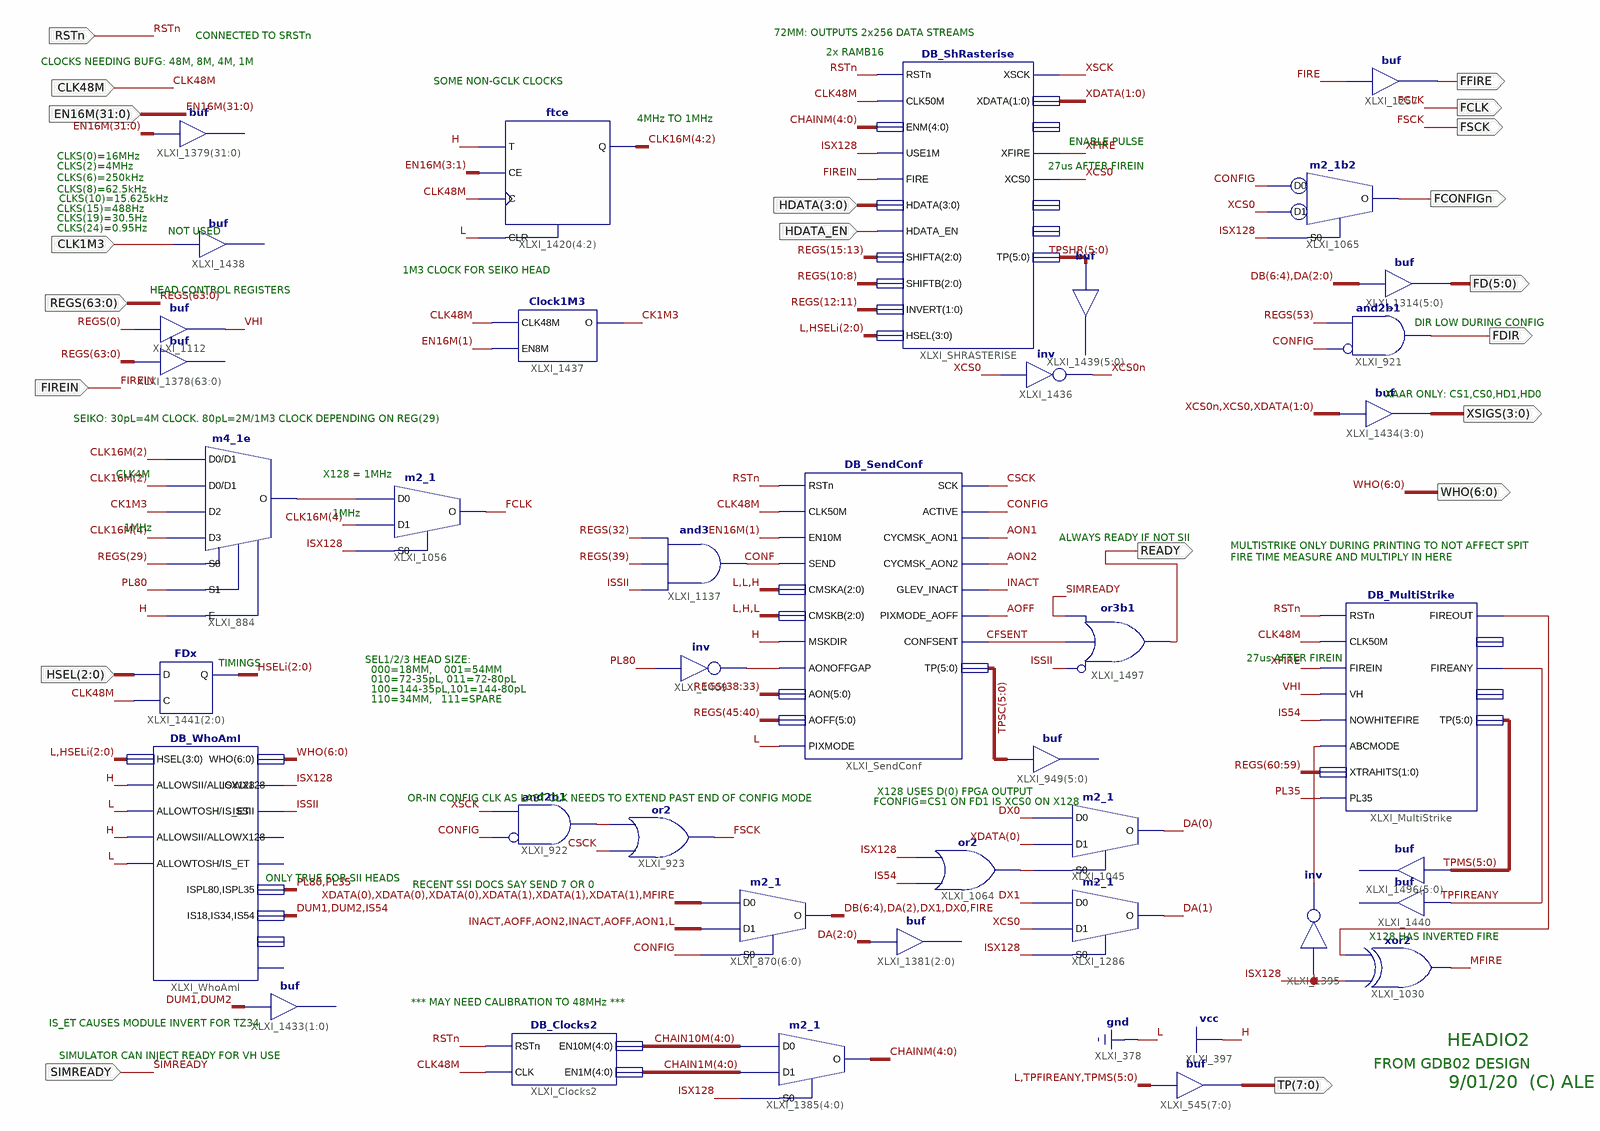
[diagram p0: schematic sheet 1]
// Xilinx ISE schematic HeadIo2.sch (spartan3e) as structural Verilog: 39 symbols, 20 ports
module HeadIo2 (
  input  CLK48M,
  input  RSTn,
  input  FIREIN,
  input  CLK1M3,
  input  [31:0] EN16M,
  input  [3:0] HDATA,
  input  HDATA_EN,
  input  [63:0] REGS,
  input  [2:0] HSEL,
  input  SIMREADY,
  output FSCK,
  output [7:0] TP,
  output [6:0] WHO,
  output FCLK,
  output FFIRE,
  output [5:0] FD,
  output FDIR,
  output FCONFIGn,
  output [3:0] XSIGS,
  output READY
);

  wire AOFF, AON1, AON2, CFSENT, CK1M3, CONF, CONFIG, CSCK, DUM1, DUM2, DX0, DX1, FIRE, INACT, IS54, ISSII,
       ISX128, MFIRE, PL35, PL80, TPFIREANY, VHI, XCS0, XCS0n, XFIRE, XLXN_2119, XLXN_2291, XLXN_2369,
       XLXN_2422, XLXN_2426, XLXN_2589, XSCK;
  wire [1:0] XDATA;
  wire [2:0] DA, HSELi;
  wire [4:0] CHAIN1M, CHAIN10M, CHAINM;
  wire [4:2] CLK16M;
  wire [5:0] TPMS, TPSC, TPSHR;
  wire [6:4] DB;

  assign TP = {1'b0, TPFIREANY, TPMS};  // buf XLXI_545[7..0], 8 bits wide
  // buf XLXI_1379[31..0] has open pins: I=EN16M, O=open
  buf XLXI_1257 (FFIRE, FIRE);
  assign FD = {DB, DA};  // buf XLXI_1314[5..0], 6 bits wide
  and XLXI_921 (FDIR, ~CONFIG, REGS[53]);  // and2b1
  m2_1b2 XLXI_1065 (.D0(CONFIG), .D1(XCS0), .S0(ISX128), .O(FCONFIGn));
  DB_Clocks2 XLXI_Clocks2 (.CLK(CLK48M), .EN10M(CHAIN10M), .EN1M(CHAIN1M), .RSTn(RSTn));
  m2_1 XLXI_1385[4:0] (.D0(CHAIN10M), .D1(CHAIN1M), .S0(ISX128), .O(CHAINM));
  ftce XLXI_1420[4:2] (.C(CLK48M), .CE(EN16M[3:1]), .CLR(1'b0), .T(1'b1), .Q(CLK16M));
  and XLXI_922 (XLXN_2291, ~CONFIG, XSCK);  // and2b1
  or XLXI_923 (FSCK, CSCK, XLXN_2291);
  m2_1 XLXI_870[6:0] (
    .D0({{3{XDATA[0]}}, {3{XDATA[1]}}, MFIRE}), .D1({INACT, AOFF, AON2, INACT, AOFF, AON1, 1'b0}),
    .S0(CONFIG), .O({DB, DA[2], DX1, DX0, FIRE}));
  // buf XLXI_1381[2..0] has open pins: I=DA, O=open
  DB_ShRasterise XLXI_SHRASTERISE (
    .CLK50M(CLK48M), .ENM(CHAINM), .FIRE(FIREIN), .HDATA(HDATA), .HDATA_EN(HDATA_EN), .HSEL({1'b0, HSELi}),
    .INVERT(REGS[12:11]), .RSTn(RSTn), .SHIFTA(REGS[15:13]), .SHIFTB(REGS[10:8]), .TP(TPSHR), .USE1M(ISX128),
    .XCS0(XCS0), .XDATA(XDATA), .XFIRE(XFIRE), .XSCK(XSCK));  // open: AOUT, PULSE, XDATMX
  assign XSIGS = {XCS0n, XCS0, XDATA};  // buf XLXI_1434[3..0], 4 bits wide
  not XLXI_1436 (XCS0n, XCS0);
  Clock1M3 XLXI_1437 (.O(CK1M3), .CLK48M(CLK48M), .EN8M(EN16M[1]));
  // buf XLXI_1438 has open pins: I=CLK1M3, O=open
  // buf XLXI_1439[5..0] has open pins: I=TPSHR, O=open
  DB_WhoAmI XLXI_WhoAmI (
    .ALLOWTOSH(1'b0), .ALLOWSII(1'b1), .ALLOWX128(1'b1), .HSEL({1'b0, HSELi}), .IS18(DUM1), .IS34(DUM2),
    .IS54(IS54), .ISPL80(PL80), .ISPL35(PL35), .ISSII(ISSII), .ISX128(ISX128), .IS_ET(1'b0), .WHO(WHO));  // open: OPTION, IS72, IS144, ISTOSH, NOFIRE
  // buf XLXI_1433[1..0] has open pins: I={DUM1, DUM2}, O=open
  buf XLXI_1112 (VHI, REGS[0]);
  // buf XLXI_1378[63..0] has open pins: I=REGS, O=open
  m2_1 XLXI_1056 (.D0(XLXN_2422), .D1(CLK16M[4]), .S0(ISX128), .O(FCLK));
  m4_1e XLXI_884 (
    .D0(CLK16M[2]), .D1(CLK16M[2]), .D2(CK1M3), .D3(CLK16M[4]), .E(1'b1), .S0(REGS[29]), .S1(PL80),
    .O(XLXN_2422));
  FDx XLXI_1441[2:0] (.C(CLK48M), .D(HSEL), .Q(HSELi));
  or XLXI_1064 (XLXN_2426, IS54, ISX128);
  m2_1 XLXI_1286 (.D0(DX1), .D1(XCS0), .S0(ISX128), .O(DA[1]));
  m2_1 XLXI_1045 (.D0(DX0), .D1(XDATA[0]), .S0(XLXN_2426), .O(DA[0]));
  DB_SendConf XLXI_SendConf (
    .ACTIVE(CONFIG), .AOFF(REGS[45:40]), .AON(REGS[38:33]), .AONOFFGAP(XLXN_2119), .CLK50M(CLK48M),
    .CMSKA(3'b001), .CMSKB(3'b010), .CONFSENT(CFSENT), .CYCMSK_AON1(AON1), .CYCMSK_AON2(AON2),
    .EN10M(EN16M[1]), .GLEV_INACT(INACT), .MSKDIR(1'b1), .PIXMODE(1'b0), .PIXMODE_AOFF(AOFF), .RSTn(RSTn),
    .SCK(CSCK), .SEND(CONF), .TP(TPSC));
  not XLXI_1409 (XLXN_2119, PL80);
  // buf XLXI_949[5..0] has open pins: I=TPSC, O=open
  and XLXI_1137 (CONF, ISSII, REGS[39], REGS[32]);
  DB_MultiStrike XLXI_MultiStrike (
    .ABCMODE(XLXN_2589), .CLK50M(CLK48M), .FIREANY(TPFIREANY), .FIREIN(XFIRE), .FIREOUT(XLXN_2369),
    .NOWHITEFIRE(IS54), .PL35(PL35), .RSTn(RSTn), .TP(TPMS), .VH(VHI), .XTRAHITS(REGS[60:59]));  // open: FIREABC, XHITS
  xor XLXI_1030 (MFIRE, ISX128, XLXN_2369);
  not XLXI_1395 (XLXN_2589, ISX128);
  // buf XLXI_1440 has open pins: I=TPFIREANY, O=open
  // buf XLXI_1496[5..0] has open pins: I=TPMS, O=open
  or XLXI_1497 (READY, ~ISSII, CFSENT, SIMREADY);  // or3b1

  // Notes on the sheet:
  //   72MM: OUTPUTS 2x256 DATA STREAMS
  //   CONNECTED TO SRSTn
  //   2x RAMB16
  //   CLOCKS NEEDING BUFG: 48M, 8M, 4M, 1M
  //   SOME NON-GCLK CLOCKS
  //   4MHz TO 1MHz
  //   ENABLE PULSE
  //   CLKS(0)=16MHz
  //   CLKS(2)=4MHz
  //   27us AFTER FIREIN
  //   CLKS(6)=250kHz
  //   CLKS(8)=62.5kHz
  //   CLKS(10)=15.625kHz
  //   CLKS(15)=488Hz
  //   CLKS(19)=30.5Hz
  //   CLKS(24)=0.95Hz
  //   NOT USED
  //   1M3 CLOCK FOR SEIKO HEAD
  //   HEAD CONTROL REGISTERS
  //   DIR LOW DURING CONFIG
  //   XAAR ONLY: CS1,CS0,HD1,HD0
  //   SEIKO: 30pL=4M CLOCK. 80pL=2M/1M3 CLOCK DEPENDING ON REG(29)
  //   CLK4M
  //   X128 = 1MHz
  //   1MHz
  //   1MHz
  //   ALWAYS READY IF NOT SII
  //   MULTISTRIKE ONLY DURING PRINTING TO NOT AFFECT SPIT
  //   FIRE TIME MEASURE AND MULTIPLY IN HERE
  //   27us AFTER FIREIN
  //   SEL1/2/3 HEAD SIZE:
  //   TIMINGS
  //   000=18MM,    001=54MM
  //   010=72-35pL, 011=72-80pL
  //   100=144-35pL,101=144-80pL
  //   110=34MM,   111=SPARE
  //   X128 USES D(0) FPGA OUTPUT
  //   OR-IN CONFIG CLK AS LAST CLK NEEDS TO EXTEND PAST END OF CONFIG MODE
  //   FCONFIG=CS1 ON FD1 IS XCS0 ON X128
  //   ONLY TRUE FOR SII HEADS
  //   RECENT SSI DOCS SAY SEND 7 OR 0
  //   X128 HAS INVERTED FIRE
  //   *** MAY NEED CALIBRATION TO 48MHz ***
  //   IS_ET CAUSES MODULE INVERT FOR TZ34
  //   HEADIO2
  //   SIMULATOR CAN INJECT READY FOR VH USE
  //   FROM GDB02 DESIGN
  //   9/01/20  (C) ALE
endmodule
